# EAGLE design sonopi-dac-type2 (EAGLE 9.6.1)
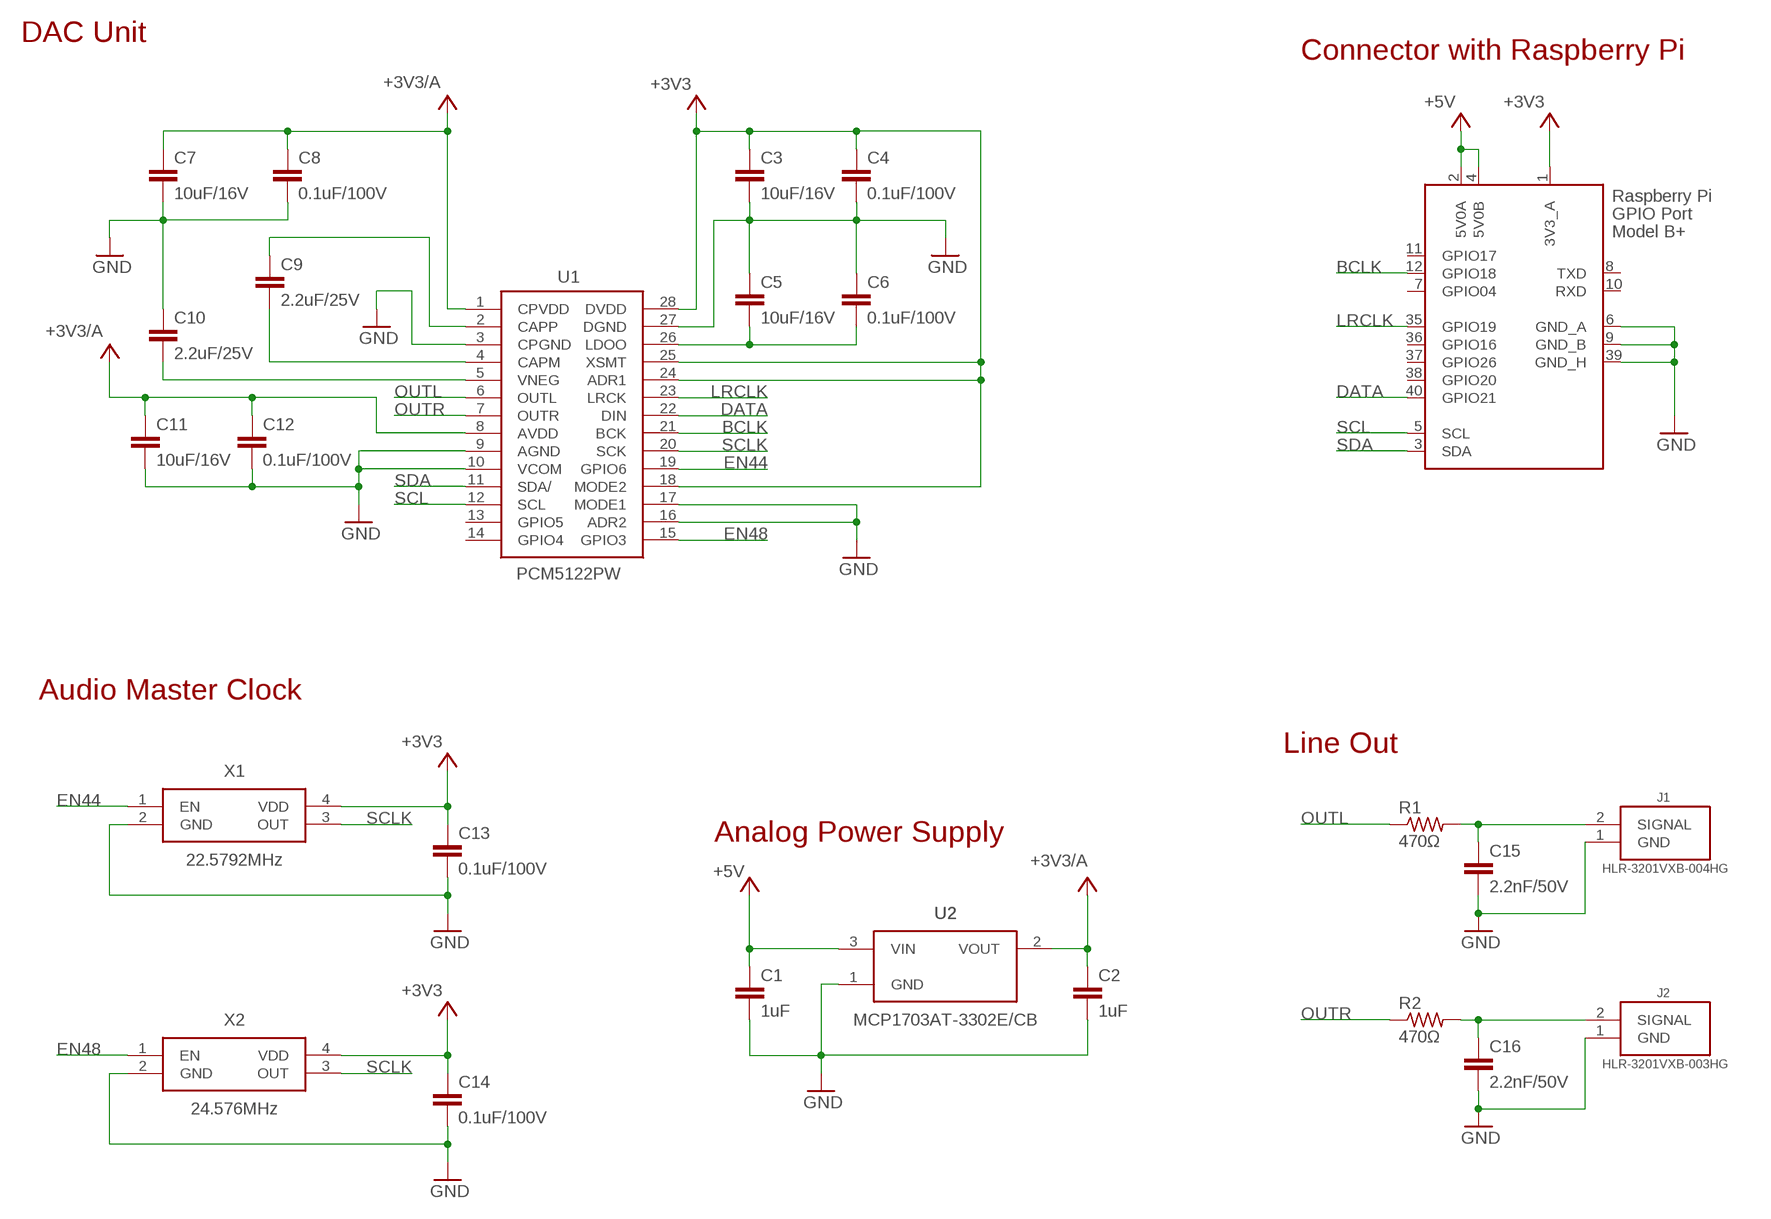
[diagram p0: schematic, sheet 1]

## Parts
C1  1uF  C-EUC0603  [C0603]
C2  1uF  C-EUC0603  [C0603]
C3  10uF/16V  C-EUC3216  [C3216]
C4  0.1uF/100V  C-EUC0603  [C0603]
C5  10uF/16V  C-EUC3216  [C3216]
C6  0.1uF/100V  C-EUC0603  [C0603]
C7  10uF/16V  C-EUC3216  [C3216]
C8  0.1uF/100V  C-EUC0603  [C0603]
C9  2.2uF/25V  C-EUC0805  [C0805]
C10  2.2uF/25V  C-EUC0805  [C0805]
C11  10uF/16V  C-EUC3216  [C3216]
C12  0.1uF/100V  C-EUC0603  [C0603]
C13  0.1uF/100V  C-EUC0603  [C0603]
C14  0.1uF/100V  C-EUC0603  [C0603]
C15  2.2nF/50V  C-EUC0603  [C0603]
C16  2.2nF/50V  C-EUC0603  [C0603]
J1  HLR-3201VXB-004HG  1CH-RCA-HLR-3201VXB  [HLR-3201VXB]
J2  HLR-3201VXB-003HG  1CH-RCA-HLR-3201VXB  [HLR-3201VXB]
J3  RASPI_BOARD_B+#_ZERO  [RASPI_BOARD_B+HAT_ZERO]
R1  470Ω  R-US_R0603  [R0603]
R2  470Ω  R-US_R0603  [R0603]
U1  PCM5122PW  [SOP65P640X120-28N]
U2  MCP1703AT-3302E/CB  LDO-REGULATOR  [SOT23]
X1  22.5792MHz  OSC-3225HS  [3225-SMD-HS]
X2  24.576MHz  OSC-3225HS  [3225-SMD-HS]

## Nets
+3V3: C3.1 C4.1 C13.1 C14.1 J3.1(3V3_A) U1.18(MODE2) U1.24(ADR1) U1.25(XSMT) U1.28(DVDD) X1.4(VDD) X2.4(VDD)
+3V3/A: C2.1 C7.1 C8.1 C11.1 C12.1 U1.1(CPVDD) U1.8(AVDD) U2.2(VOUT)
+5V [pwr]: C1.1 J3.2(5V0A) J3.4(5V0B) U2.3(VIN)
BCLK: J3.12(GPIO18) U1.21(BCK)
CAPM: C9.2 U1.4(CAPM)
CAPP: C9.1 U1.2(CAPP)
DATA: J3.40(GPIO21) U1.22(DIN)
EN44: U1.19(GPIO6) X1.1(EN)
EN48: U1.15(GPIO3) X2.1(EN)
GND [gnd]: C1.2 C2.2 C3.2 C4.2 C5.1 C6.1 C7.2 C8.2 C10.1 C11.2 C12.2 C13.2 C14.2 C15.2 C16.2 J1.1(GND) J2.1(GND) J3.6(GND_A) J3.9(GND_B) J3.39(GND_H) U1.3(CPGND) U1.9(AGND) U1.10(VCOM) U1.16(ADR2) U1.17(MODE1) U1.27(DGND) U2.1(GND) X1.2(GND) X2.2(GND)
LCH: C15.1 J1.2(SIGNAL) R1.2
LDOO: C5.2 C6.2 U1.26(LDOO)
LRCLK: J3.35(GPIO19) U1.23(LRCK)
OUTL: R1.1 U1.6(OUTL)
OUTR: R2.1 U1.7(OUTR)
RCH: C16.1 J2.2(SIGNAL) R2.2
SCL: J3.5(SCL) U1.12(SCL)
SCLK: U1.20(SCK) X1.3(OUT) X2.3(OUT)
SDA: J3.3(SDA) U1.11(SDA/)
VNEG: C10.2 U1.5(VNEG)
Unconnected: J3.7(GPIO04) J3.8(TXD) J3.10(RXD) J3.11(GPIO17) J3.36(GPIO16) J3.37(GPIO26) J3.38(GPIO20) U1.13(GPIO5) U1.14(GPIO4)

## Notes on the sheet
- DAC Unit
- Connector with Raspberry Pi
- Audio Master Clock
- Line Out
- Analog Power Supply

## Library data of the parts
C1-C16 = rcl:C-EU: CAPACITOR, European symbol; SPICEPREFIX: C
J1 J2 = RCA-jack:1CH-RCA
J3 = raspi-zero-i2s:RASPI_BOARD_B+#: Raspberry Pi GPIO connector with markings for the outer dimensions of the Raspberry Pi board model B+ with different sets of drill holes or mounting pads All pins connected
R1 R2 = rcl:R-US_: RESISTOR, American symbol; SPICEPREFIX: R
U1 = PCM5122:PCM5122PW: 2V RMS DIRECTPATH 112dB Audio Stereo DAC with PCM Interface and Fixed Audio Processing Source: Datasheet <http://www.ti.com/general/docs/lit/getliterature.tsp?genericPartNumber=PCM5122&&fileType=pdf>; DESCRIPTION: 2V RMS DIRECTPATH 112dB Audio Stereo DAC with PCM Interface and Fixed Audio Processing; HEIGHT: 1.2mm; MANUFACTURER_NAME: Texas Instruments; MANUFACTURER_PART_NUMBER: PCM5122PW; MOUSER_PART_NUMBER: 595-PCM5122PW; MOUSER_PRICE-STOCK: https://www.mouser.com/Search/Refine.aspx?Keyword=595-PCM5122PW; RS_PART_NUMBER: 8143732P; RS_PRICE-STOCK: http://uk.rs-online.com/web/p/products/8143732P
U2 = SOT23_Module:LDO-REGULATOR
X1 X2 = oscillator:OSC

## Net classes
1 gnd: width 0.2 mm, clearance 0.1 mm
2 pwr: width 0.2 mm, clearance 0.1 mm

## Board
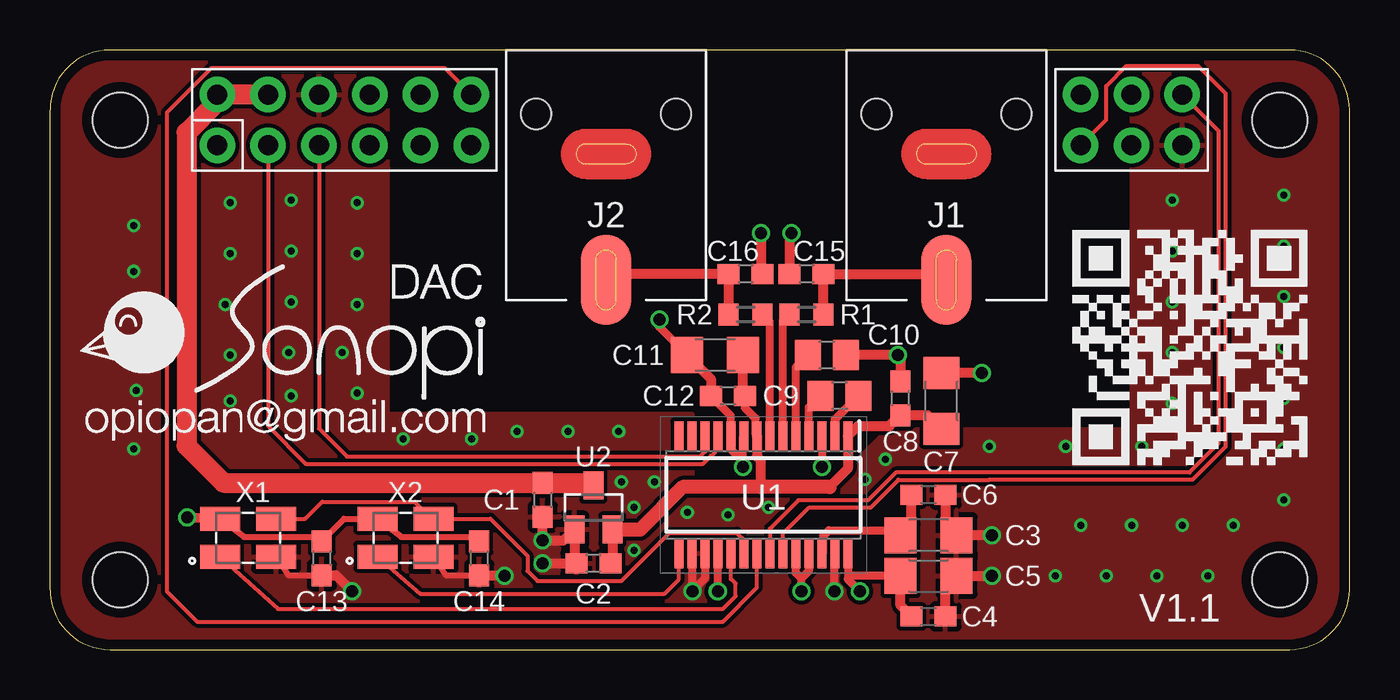
[diagram p1: board, top side]
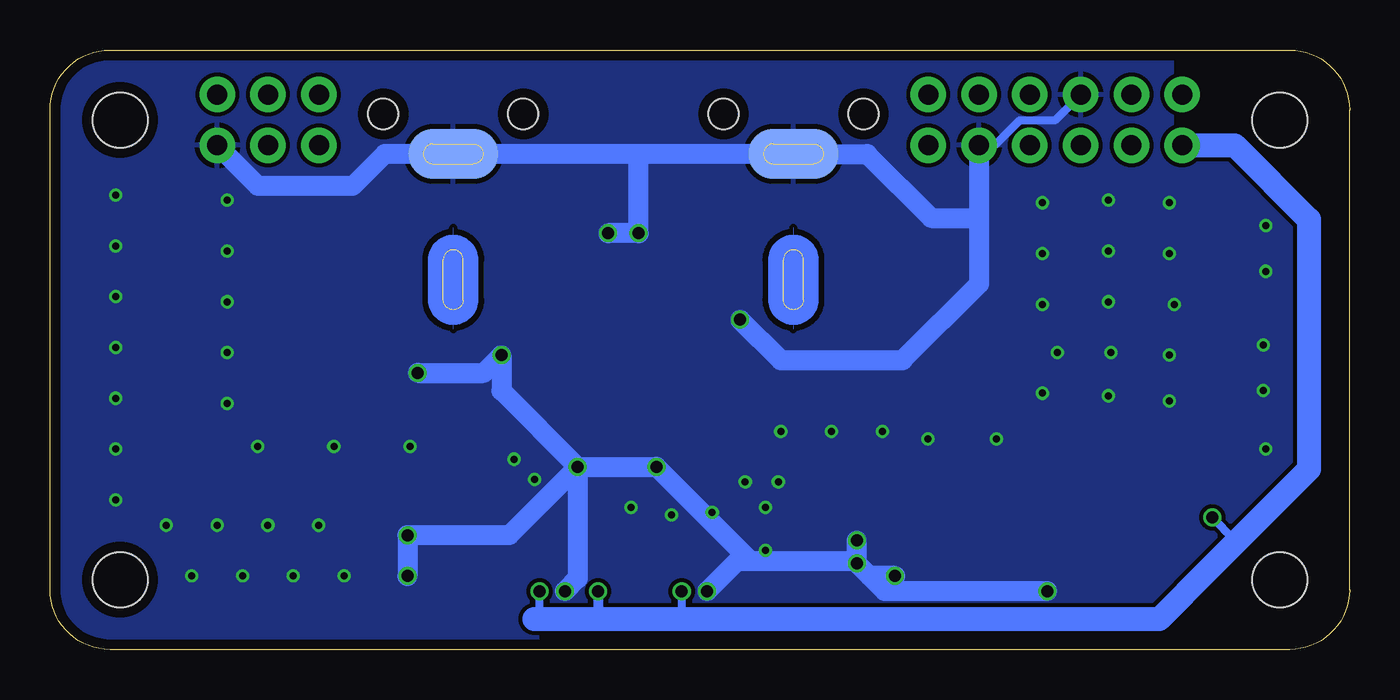
[diagram p2: board, bottom side, seen from below]

Size 65 x 30 mm. Coordinates in mm from the lower left corner, seen from the top.
Copper layers (1*16): Top 0.035mm / dielectric 1.6mm / Bottom 0.035mm
Design rules "Elecrow_2-layer_PCB_eagle_rule": minimum track width 6mil, minimum drill 12mil, track to track 6mil, track to pad 6mil, pad to pad 6mil, via to via 8mil, smd to smd 0mil, copper to edge 20mil, drill to drill 10mil, minimum pad ring 6mil, minimum via ring 6mil, stop-mask expansion 0mil, vias tented up to drill 100mil, thermal gap 10mil

### Footprints (pad centres in the part's own frame; a part is rotated, then mirrored left to right if it is on the bottom)
C0603 = smd 1.1 x 1: 1 -0.85,0; 2 0.85,0
C3216 = smd 1.6 x 1.8: 1 -1.4,0; 2 1.4,0
C0805 = smd 1.3 x 1.5: 1 -0.95,0; 2 0.95,0
HLR-3201VXB = smd 4.5 x 2.5 bottom: 1 0,5.2 | smd 2.5 x 4.5: 2 0,11.5 | hole 1.5: -3.5,3.2; 3.5,3.2
RASPI_BOARD_B+HAT_ZERO = drill 1 pad 1.778: 1 8.37,25.23; 2 8.37,27.77; 3 10.91,25.23; 4 10.91,27.77; 5 13.45,25.23; 6 13.45,27.77; 7 15.99,25.23; 8 15.99,27.77; 9 18.53,25.23; 10 18.53,27.77; 11 21.07,25.23; 12 21.07,27.77; 35 51.55,25.23; 36 51.55,27.77; 37 54.09,25.23; 38 54.09,27.77; 39 56.63,25.23; 40 56.63,27.77 | hole 2.75: 3.5,26.5; 61.5,26.5; 3.5,3.5; 61.5,3.5
R0603 = smd 1 x 1.1: 1 -0.85,0; 2 0.85,0
SOP65P640X120-28N = smd 1.475 x 0.45: 1 -2.938,4.225; 2 -2.938,3.575; 3 -2.938,2.925; 4 -2.938,2.275; 5 -2.938,1.625; 6 -2.938,0.975; 7 -2.938,0.325; 8 -2.938,-0.325; 9 -2.938,-0.975; 10 -2.938,-1.625; 11 -2.938,-2.275; 12 -2.938,-2.925; 13 -2.938,-3.575; 14 -2.938,-4.225; 15 2.938,-4.225; 16 2.938,-3.575; 17 2.938,-2.925; 18 2.938,-2.275; 19 2.938,-1.625; 20 2.938,-0.975; 21 2.938,-0.325; 22 2.938,0.325; 23 2.938,0.975; 24 2.938,1.625; 25 2.938,2.275; 26 2.938,2.925; 27 2.938,3.575; 28 2.938,4.225
SOT23 = smd 1 x 1.4: 1 -0.95,-1.1; 2 0.95,-1.1; 3 0,1.1
3225-SMD-HS = smd 2 x 1.2: 1 -1.4,-0.95; 2 1.4,-0.95; 3 1.4,0.95; 4 -1.4,0.95

### Placement (x,y rotation side)
C1  24.64,7.49 270 top
C2  27.18,4.32 180 top
C3  43.94,3.68 0 top
C4  43.94,1.65 0 top
C5  43.94,5.71 180 top
C6  43.94,7.75 180 top
C7  44.58,12.45 90 top
C8  42.55,12.57 90 top
C9  39.5,12.7 180 top
C10  38.86,14.73 180 top
C11  33.27,14.73 180 top
C12  33.91,12.7 180 top
C13  13.59,4.57 270 top
C14  21.46,4.57 270 top
C15  37.85,18.8 180 top
C16  34.8,18.8 0 top
J1  44.83,30 180 top
J2  27.81,30 180 top
J3  0,0 0 top
R1  37.85,16.76 0 top
R2  34.8,16.76 180 top
U1  35.69,7.75 270 top
U2  27.18,7.11 0 top
U$1  [SONOPI-DAC-LOGO]  0.76,9.14 0 top
U$2  [SONOPI-DAC-QRCODE]  49.53,7.62 0 top
X1  9.91,5.59 0 top
X2  17.78,5.59 0 top

### Tracks (layer width: path | path; a pad name or v marks a point on that pad's centre or on a via)
+3V3  (via drill 0.6)
  Top 0.3: C14.1 21.25,5.64 17.58,5.64 X2.4 14.71,6.54 C13.1 13.38,5.64 9.71,5.64 X1.4 | 6.92,6.54 v6.86,6.6
  Top 0.4: U1.28 39.91,3.52 | 39.91,3.52 v40.51,2.92 | C3.1 40.07,3.68 39.91,3.52 | v33.4,2.92 33.4,4.8 U1.18 | v37.59,2.92 37.59,3.56 | U1.24 37.31,3.84 37.59,3.56 | U1.25 37.96,3.93 37.59,3.56 | 6.92,6.54 X1.4 8.44,6.6 v6.86,6.6
  Top 0.5: C4.1 42.54,2.2 C3.1 | 8.76,6.58 X1.4
  Top 1: 8.74,6.6 X1.4
  Bottom 0.4: 40.77,1.52 40.51,1.78 v40.51,2.92 | v33.4,2.92 33.4,1.78 33.15,1.52 | v6.86,6.6 5.78,5.52 5.78,5.27
  Bottom 0.5: 4.89,6.29 4.89,6.16 | v37.59,2.92 37.59,1.52
  Bottom 1: 7.11,4.06 6.99,4.06
  Bottom 1.2: 40.77,1.52 37.59,1.52 33.15,1.52 9.53,1.52 6.99,4.06 5.78,5.27 4.89,6.16 2.03,9.02 2.03,21.52 5.74,25.23 J3.1
+3V3/A
  Top 0.4: U1.8 35.29,10.76 35.29,11.57 34.76,12.1 C12.1
  Top 0.5: C12.1 34.67,12.79 C11.1 | C7.1 43.9,11.72 C8.1 42,11.18 40.4,11.18 U1.1 39.91,9.05 38.99,8.13 | U2.2 28.13,4.42 C2.1 | U1.8 35.36,9.66 35.53,9.5 35.53,8.16 35.56,8.13
  Top 0.7: U2.2 29.52,6.01 31.64,8.13 35.56,8.13 38.99,8.13
+5V
  Top 1: J3.4 J3.2 8.37,27.41 6.83,25.87 6.83,10.19 8.68,8.34 C1.1 27.05,8.34 U2.3
BCLK
  Top 0.2: J3.12 19.76,29.08 8.07,29.08 5.84,26.86 5.84,2.92 7.37,1.4 33.66,1.4 35.36,3.1 U1.21
CAPM
  Top 0.4: U1.4 37.96,12.12 C9.2
CAPP
  Top 0.4: U1.2 39.26,11.52 C9.1
DATA
  Top 0.2: J3.40 58.45,25.95 58.45,10.32 56.99,8.86 42.3,8.86 40.9,7.46 37.44,7.46 36.01,6.04 U1.22
EN44
  Top 0.2: X1.1 11.41,2.03 33.66,2.03 34.29,2.67 34.29,3.3 34.06,3.53 U1.19
EN48
  Top 0.2: 16.68,4.38 X2.1 18.52,2.79 30.73,2.79 31.46,3.52 U1.15
GND  (via drill 0.35, 0.6)
  Top 0.3: X1.2 11.92,3.72 C13.2 | X2.2 19.8,3.72 C14.2
  Top 0.4: U1.3 v38.61,9.15 v38.61,9.14 | v34.67,9.14 34.67,9.4 | 34.67,9.4 34.67,10.64 U1.9 | 34.67,9.4 34.06,10.01 U1.10 34.06,11.7 C12.2 | v30.48,16.51 30.48,16.13 C11.2 | 44.79,3.13 C3.2 | v39.24,2.92 39.24,4.79 U1.27 | U1.16 32.13,4.79 v32.13,2.92 32.76,3.55 U1.17
  Top 0.5: C10.1 v42.42,14.73 42.55,14.61 C8.2 | C7.2 v46.61,13.84 | C11.2 33.06,13.55 C12.2 | C4.2 44.79,3.13 | C3.2 v47.12,3.68 | v47.12,5.71 C5.1 44.79,6.26 C6.1 | C1.2 v24.64,5.46 25.68,5.46 U2.1 26.23,4.42 C2.2 v24.64,4.32 | C13.2 14.31,3.72 v15.11,2.92 | C16.2 35.56,18.88 v35.56,20.83 | v37.08,20.83 37,20.74 C15.2 | v22.73,3.68 21.5,3.68 C14.2
  Bottom 0.4: J3.6 14.75,26.47 16.5,26.47 17.75,25.23 J3.9
  Bottom 1: v46.61,13.84 43.31,13.84 v42.42,14.73 42.42,12.95 v38.61,9.14 | J3.9 18.53,21.59 | 18.53,21.59 18.53,18.3 22.35,14.48 28.45,14.48 v30.48,16.51 | v38.61,9.14 v34.67,9.14 29.97,4.45 | v38.61,9.14 38.61,3.56 v39.24,2.92 | v38.61,9.14 42.04,5.71 v47.12,5.71 v47.12,3.68 | v24.64,4.32 24.77,4.45 29.97,4.45 | v32.13,2.92 30.61,4.45 29.97,4.45 | v24.64,4.32 v24.64,5.46 | v15.11,2.92 23.24,2.92 v24.64,4.32 | 35.56,24.8 J2.1 24.13,24.8 20.92,21.59 18.53,21.59 | 35.56,24.8 J1.1 48.26,24.8 49.87,23.2 54.59,23.2 J3.39 | 35.56,24.8 v35.56,20.83 v37.08,20.83 | v22.73,3.68 24,3.68 v24.64,4.32
  other vias: 4.19,21.21 4.19,18.92 4.32,15.24 4.32,12.95 4.19,10.03 9.02,22.35 9.02,19.81 8.76,17.27 9.02,14.73 9.02,12.45 12.06,22.48 12.06,19.94 12.06,17.4 11.94,14.86 12.06,12.7 40.77,8.51 41.78,9.53 61.72,22.73 15.37,22.35 15.37,19.81 15.37,17.27 14.61,14.86 15.37,12.83 17.65,10.54 21.08,10.54 23.37,10.92 25.91,10.92 28.45,10.92 46.99,10.16 50.8,10.16 54.61,10.16 56.13,12.32 56.13,14.86 56.13,17.4 56.13,19.94 56.13,22.48 61.72,20.19 61.72,17.65 61.72,15.11 61.72,12.57 61.72,10.03 61.72,7.49 59.18,6.22 56.64,6.22 54.1,6.22 51.56,6.22 57.91,3.68 55.37,3.68 52.83,3.68 50.29,3.68 28.57,8.38 30.23,8.38 29.21,7.11 31.88,6.86 33.91,6.73 29.21,4.95 35.94,7.11
  pour Bottom (isolate 0.2): 8.89,30.48 8.89,25.4 8.64,25.15 5.71,25.15 2.29,21.72 2.16,21.72 2.16,8.89 9.78,1.27 40.51,1.27 40.64,1.14 40.64,0 64.77,0 64.77,30.48
  pour Top (isolate 0.2): 16.89,30.99 16.89,12.32 16.89,11.81 32.13,11.81 32.13,8.38 32.38,8.13 38.99,8.13 40.01,9.14 41.91,11.05 54.1,11.05 54.1,30.35 65.15,30.35 65.41,30.1 65.41,0.38 64.64,-0.38 -0.76,-0.38 -0.89,-0.51 -0.89,30.86 -0.76,30.99
LCH
  Top 0.5: R1.2 C15.1 44.53,18.8 J1.2
LDOO
  Top 0.4: U1.26 38.69,4.88 38.69,5.69 38.96,5.97 42.29,5.97 C5.2
  Top 0.5: C5.2 43.09,6.26 C6.2
LRCLK
  Top 0.2: J3.35 52.83,26.51 52.83,28.19 53.85,29.21 57.4,29.21 58.8,27.81 58.8,10.16 57.15,8.51 46.99,8.51 46.98,8.5 42.44,8.5 41.05,7.11 37.97,7.11 36.66,5.8 U1.23
OUTL
  Top 0.4: U1.6 36.66,16.43 R1.1
OUTR
  Top 0.4: U1.7 36.01,16.4 R2.1
RCH
  Top 0.5: R2.2 C16.1 28.11,18.8 J2.2
SCL
  Top 0.2: J3.5 13.45,11.06 14.86,9.65 32.51,9.65 32.77,9.91 U1.12
SCLK
  Top 0.2: U1.20 34.71,5.48 34.35,5.84 30.99,5.84 | 30.96,5.84 30.99,5.84 | 30.99,5.84 28.57,3.43 24.38,3.43 23.88,3.94 23.88,4.7 22.04,6.54 X2.3 19.1,6.54 18.25,7.39 13.61,7.39 12.76,6.54 X1.3
SDA
  Top 0.2: U1.11 33.41,10.04 33.24,9.87 33.24,9.84 33.09,9.7 33.05,9.7 32.66,9.3 12.8,9.3 10.91,11.19 J3.3
VNEG
  Top 0.4: U1.5 37.31,14.13 C10.2

### Text on the board
tPlace: V1.1